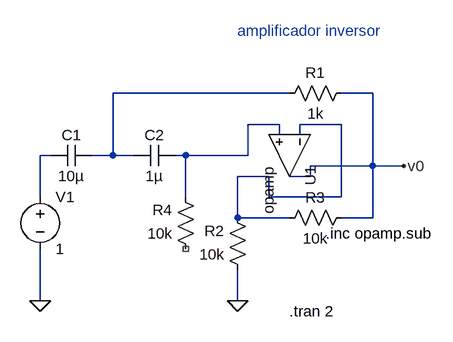
[diagram p0: schematic opampInversor copy.asc]
opampInversor copy.asc, the LTspice schematic file:
Version 4
SHEET 1 880 680
WIRE 416 192 144 192
WIRE 544 192 496 192
WIRE 400 240 352 240
WIRE 496 240 432 240
WIRE 400 256 400 240
WIRE 432 256 432 240
WIRE 48 288 32 288
WIRE 144 288 144 192
WIRE 144 288 112 288
WIRE 176 288 144 288
WIRE 256 288 240 288
WIRE 352 288 352 240
WIRE 352 288 256 288
WIRE 544 304 544 192
WIRE 544 304 448 304
WIRE 592 304 544 304
WIRE 384 320 336 320
WIRE 448 320 448 304
WIRE 448 320 416 320
WIRE 32 352 32 288
WIRE 256 352 256 288
WIRE 384 352 384 320
WIRE 496 352 496 240
WIRE 496 352 384 352
WIRE 336 384 336 320
WIRE 416 384 336 384
WIRE 544 384 544 304
WIRE 544 384 496 384
WIRE 32 512 32 432
WIRE 336 512 336 464
FLAG 336 512 0
FLAG 32 512 0
FLAG 592 304 v0
SYMBOL OpAmps/opamp 480 288 R90
SYMATTR InstName U1
SYMBOL Res 400 208 R270
WINDOW 0 32 56 VTop 2
WINDOW 3 0 56 VBottom 2
SYMATTR InstName R1
SYMATTR Value 1k
SYMBOL Voltage 32 336 R0
SYMATTR InstName V1
SYMATTR Value 1
SYMBOL Res 352 480 R180
WINDOW 0 36 76 Left 2
WINDOW 3 36 40 Left 2
SYMATTR InstName R2
SYMATTR Value 10k
SYMBOL Res 512 368 R90
WINDOW 0 0 56 VBottom 2
WINDOW 3 32 56 VTop 2
SYMATTR InstName R3
SYMATTR Value 10k
SYMBOL Res 272 448 R180
WINDOW 0 36 76 Left 2
WINDOW 3 36 40 Left 2
SYMATTR InstName R4
SYMATTR Value 10k
SYMBOL Cap 112 272 R90
WINDOW 0 0 32 VBottom 2
WINDOW 3 32 32 VTop 2
SYMATTR InstName C1
SYMATTR Value 10µ
SYMATTR SpiceLine IC=0
SYMBOL Cap 240 272 R90
WINDOW 0 0 32 VBottom 2
WINDOW 3 32 32 VTop 2
SYMATTR InstName C2
SYMATTR Value 1µ
SYMATTR SpiceLine IC=0
TEXT 472 408 Left 2 !.inc opamp.sub
TEXT 416 528 Left 2 !.tran 2
TEXT 336 96 Left 2 ;amplificador inversor

The netlist it stands for:
* opampInversor copy.asc
XU1 N003 N002 v0 opamp Aol=100K GBW=10Meg  ; pins invin noninvin out
R1 N001 v0 1k
V1 N004 0 1
R2 0 N003 10k
R3 v0 N003 10k
R4 NC_01 N002 10k
C1 N001 N004 10µ IC=0
C2 N002 N001 1µ IC=0
.inc opamp.sub
.tran 2
* amplificador inversor
.backanno
.end